# EAGLE board HDMI-LVDS (EAGLE 7.6.0)
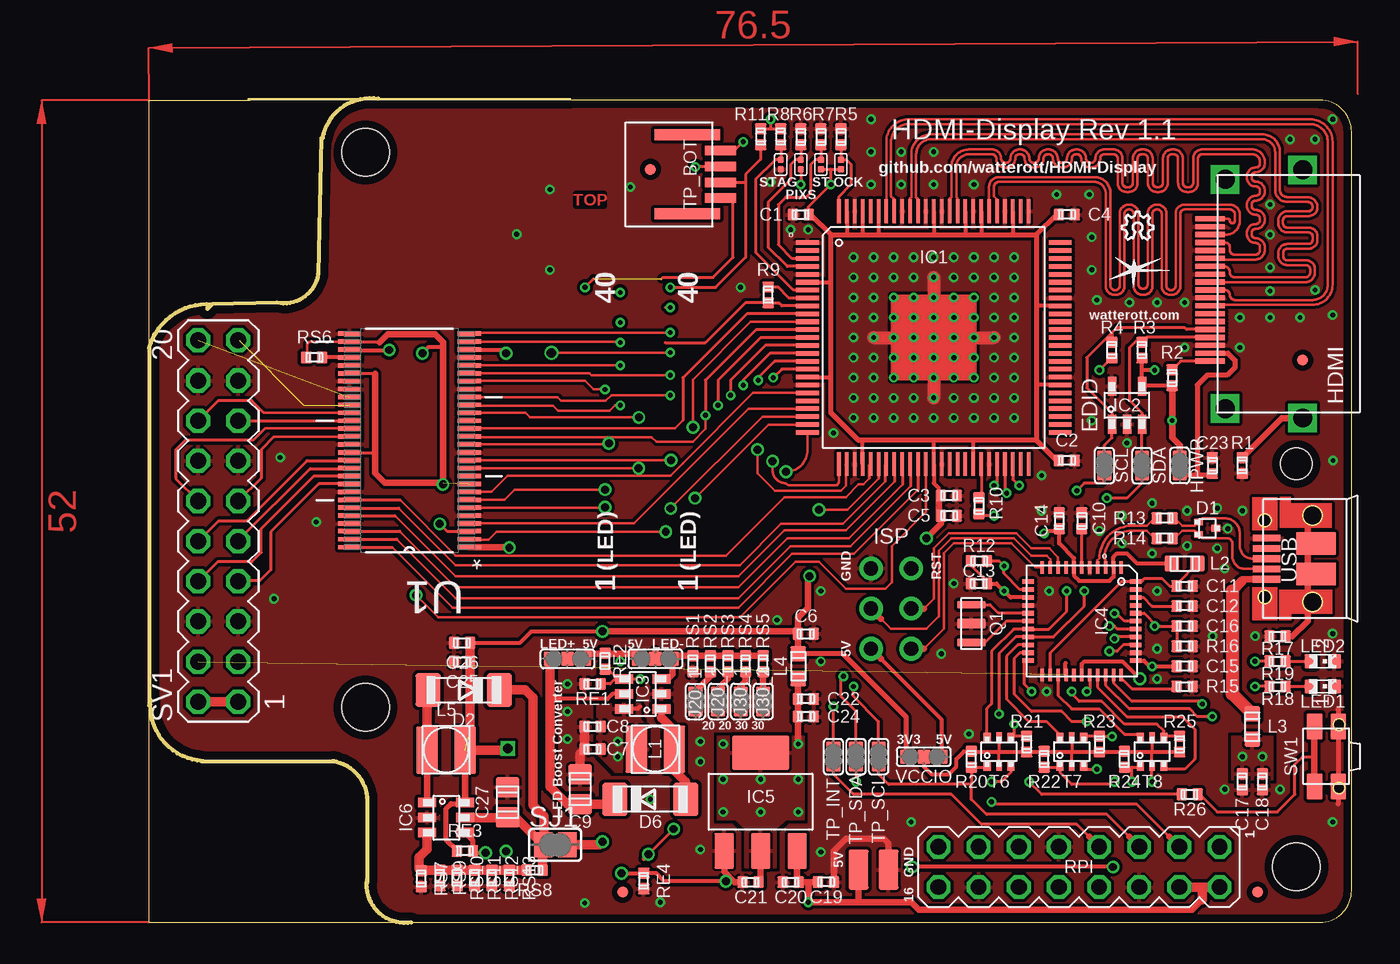
[diagram p2: board, top side]
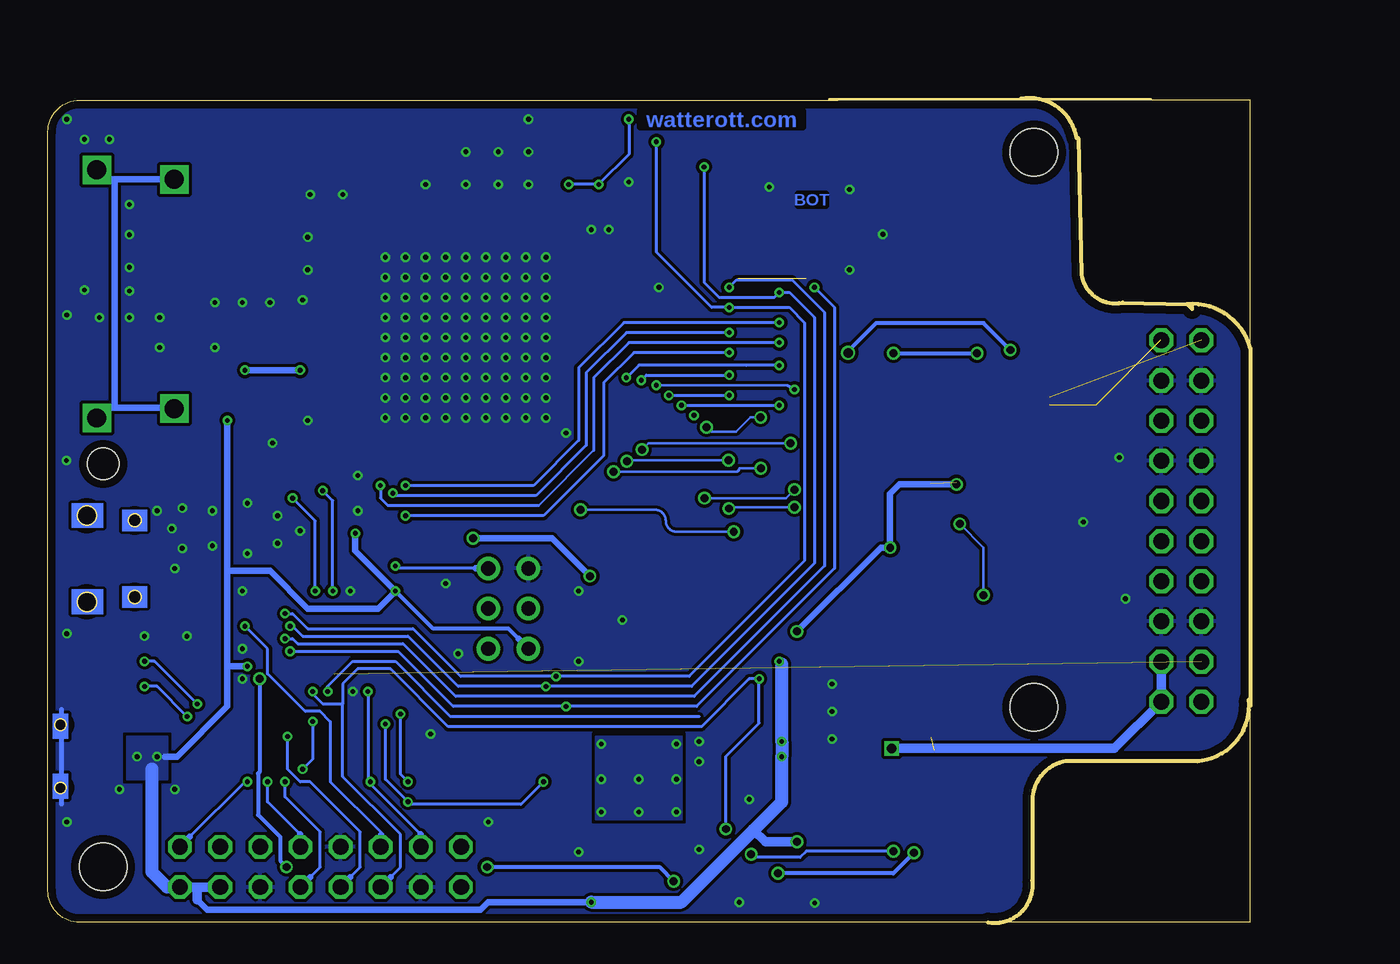
[diagram p3: board, bottom side, seen from below]

Size 76.1 x 52.18 mm. Coordinates in mm from the lower left corner, seen from the top.
Outline: 16.6,0.04 0,0.04 0,13.74 0,36.34
Outline: 16.6,0.04 74.1,0.04 arc90 76.1,2.04 76.1,50.04 arc90 74.1,52.04 26.1,52.04
Outline: 26.64,52.11 6.32,52.11
Outline: 0,36.34 0,52.04 6.4,52.04
Outline: 14.5,52.14 arc90 11,49.64 10.9,49.64 10.7,41.04 arc-94 8.1,39.24 4,39.14
Outline: 4,39.14 3.7,38.84 3.7,38.94
Outline: 0,36.34 arc-80 4,39.14
Outline: 3.4,10.24 arc-93 0.1,14.14
Outline: 3.3,10.24 11.6,10.24
Outline: 11.6,10.24 11.7,10.24
Outline: 11.6,10.24 arc-78 13.8,7.94 13.8,2.74
Outline: 13.8,2.74 13.8,2.54
Outline: 16.6,0.04 arc-108 13.8,2.74
Copper layers (1*16): Top 0.035mm / dielectric 1.5mm / Bottom 0.035mm
Design rules "default *": minimum track width 6mil, minimum drill 0.3mm, track to track 6mil, track to pad 6mil, pad to pad 6mil, via to via 6mil, smd to smd 6mil, copper to edge 20mil, drill to drill 6mil, minimum pad ring 8mil, minimum via ring 6mil, stop-mask expansion 4mil, vias tented up to drill 0.5mm, thermal gap 6mil
Net classes: 0 default: clearance 0.2 mm
Holes 3 mm at 72.6,3.54 13.7,13.64 13.7,48.74
Holes 2 mm at 72.6,29.04

## Footprints (pad centres in the part's own frame; a part is rotated, then mirrored left to right if it is on the bottom)
PAD-1.27X2.54_NC = smd 1.27 x 2.54: 1 0,0
C0402 = smd 0.75 x 0.7: 1 0,0.5; 2 0,-0.5
C0805 = smd 1.5 x 1.25: 1 0,0.95; 2 0,-0.95
SOT723 = smd 0.6 x 0.4: 1 -0.55,0.4; 2 -0.55,-0.4; 3 0.55,0
SOD106 = smd 2.1 x 1.6: A 0,-2.25; C 0,2.25
HDMI_10029449 = smd 1.9 x 0.3: 1 -0.95,4.75; 2 -0.95,4.25; 3 -0.95,3.75; 4 -0.95,3.25; 5 -0.95,2.75; 6 -0.95,2.25; 7 -0.95,1.75; 8 -0.95,1.25; 9 -0.95,0.75; 10 -0.95,0.25; 11 -0.95,-0.25; 12 -0.95,-0.75; 13 -0.95,-1.25; 14 -0.95,-1.75; 15 -0.95,-2.25; 16 -0.95,-2.75; 17 -0.95,-3.25; 18 -0.95,-3.75; 19 -0.95,-4.25 | drill 1.2 pad 1.8 square: SHLD1 0,-7.25; SHLD2 4.9,-7.85; SHLD3 4.9,7.85; SHLD4 0,7.25
JUMPER2-0402 = smd 0.9 x 0.8: 1 0,0.55; 2 0,-0.55
TQFP100-PAD = smd 1.5 x 0.28: 1 -8,6; 2 -8,5.5; 3 -8,5; 4 -8,4.5; 5 -8,4; 6 -8,3.5; 7 -8,3; 8 -8,2.5; 9 -8,2; 10 -8,1.5; 11 -8,1; 12 -8,0.5; 13 -8,0; 14 -8,-0.5; 15 -8,-1; 16 -8,-1.5; 17 -8,-2; 18 -8,-2.5; 19 -8,-3; 20 -8,-3.5; 21 -8,-4; 22 -8,-4.5; 23 -8,-5; 24 -8,-5.5; 25 -8,-6; 51 8,-6; 52 8,-5.5; 53 8,-5; 54 8,-4.5; 55 8,-4; 56 8,-3.5; 57 8,-3; 58 8,-2.5; 59 8,-2; 60 8,-1.5; 61 8,-1; 62 8,-0.5; 63 8,0; 64 8,0.5; 65 8,1; 66 8,1.5; 67 8,2; 68 8,2.5; 69 8,3; 70 8,3.5; 71 8,4; 72 8,4.5; 73 8,5; 74 8,5.5; 75 8,6 | smd 0.28 x 1.5: 26 -6,-8; 27 -5.5,-8; 28 -5,-8; 29 -4.5,-8; 30 -4,-8; 31 -3.5,-8; 32 -3,-8; 33 -2.5,-8; 34 -2,-8; 35 -1.5,-8; 36 -1,-8; 37 -0.5,-8; 38 0,-8; 39 0.5,-8; 40 1,-8; 41 1.5,-8; 42 2,-8; 43 2.5,-8; 44 3,-8; 45 3.5,-8; 46 4,-8; 47 4.5,-8; 48 5,-8; 49 5.5,-8; 50 6,-8; 76 6,8; 77 5.5,8; 78 5,8; 79 4.5,8; 80 4,8; 81 3.5,8; 82 3,8; 83 2.5,8; 84 2,8; 85 1.5,8; 86 1,8; 87 0.5,8; 88 0,8; 89 -0.5,8; 90 -1,8; 91 -1.5,8; 92 -2,8; 93 -2.5,8; 94 -3,8; 95 -3.5,8; 96 -4,8; 97 -4.5,8; 98 -5,8; 99 -5.5,8; 100 -6,8
SOT23-5 = smd 1.2 x 0.6: 1 -1.2,0.95; 2 -1.2,0; 3 -1.2,-0.95; 4 1.2,-0.95; 5 1.2,0.95
SOT23-6 = smd 1.2 x 0.6: 1 -1.2,0.95; 2 -1.2,0; 3 -1.2,-0.95; 4 1.2,-0.95; 5 1.2,0; 6 1.2,0.95
QFN44 = smd 0.8 x 0.28: 1 -3.4,2.5; 2 -3.4,2; 3 -3.4,1.5; 4 -3.4,1; 5 -3.4,0.5; 6 -3.4,0; 7 -3.4,-0.5; 8 -3.4,-1; 9 -3.4,-1.5; 10 -3.4,-2; 11 -3.4,-2.5; 23 3.4,-2.5; 24 3.4,-2; 25 3.4,-1.5; 26 3.4,-1; 27 3.4,-0.5; 28 3.4,0; 29 3.4,0.5; 30 3.4,1; 31 3.4,1.5; 32 3.4,2; 33 3.4,2.5 | smd 0.28 x 0.8: 12 -2.5,-3.4; 13 -2,-3.4; 14 -1.5,-3.4; 15 -1,-3.4; 16 -0.5,-3.4; 17 0,-3.4; 18 0.5,-3.4; 19 1,-3.4; 20 1.5,-3.4; 21 2,-3.4; 22 2.5,-3.4; 34 2.5,3.4; 35 2,3.4; 36 1.5,3.4; 37 1,3.4; 38 0.5,3.4; 39 0,3.4; 40 -0.5,3.4; 41 -1,3.4; 42 -1.5,3.4; 43 -2,3.4; 44 -2.5,3.4
SOT223 = smd 2.235 x 1.219: 1 -3.099,2.311; 2 -3.099,0; 3 -3.099,-2.311 | smd 2.2 x 3.6: 4 3.099,0
ISP-2X3 = drill 0.9 pad 1.5: GND 1.27,-2.54; MISO -1.27,2.54; MOSI 1.27,0; RST -1.27,-2.54; SCK -1.27,0; VCC 1.27,2.54
L_1212 = smd 3 x 1.4: 1 0,1.2; 2 0,-1.2
C0603 = smd 1 x 0.95: 1 0,0.8; 2 0,-0.8
C0603' = smd 0.9 x 0.8: A 0,-0.75; C 0,0.75
JUMPER3-0402 = smd 0.9 x 0.8: 1 0,1.1; 2 0,0; 3 0,-1.1
JUMPER2-0201_NC = smd 0.4 x 0.4: 1 0,0.3; 2 0,-0.3
CRYSTAL_32X13 = smd 1.8 x 0.5: 1 0,1.2; 2 0,-1.2 | smd 1.8 x 0.6: GND 0,0
MA08-2 = drill 1 octagon: 1 -1.27,8.89; 2 1.27,8.89; 3 -1.27,6.35; 4 1.27,6.35; 5 -1.27,3.81; 6 1.27,3.81; 7 -1.27,1.27; 8 1.27,1.27; 9 -1.27,-1.27; 10 1.27,-1.27; 11 -1.27,-3.81; 12 1.27,-3.81; 13 -1.27,-6.35; 14 1.27,-6.35; 15 -1.27,-8.89; 16 1.27,-8.89
SJ = smd 1.168 x 1.6: 1 -0.762,0; 2 0.762,0
MA10-2 = drill 1.016 octagon: 1 -11.43,-1.27; 2 -11.43,1.27; 3 -8.89,-1.27; 4 -8.89,1.27; 5 -6.35,-1.27; 6 -6.35,1.27; 7 -3.81,-1.27; 8 -3.81,1.27; 9 -1.27,-1.27; 10 -1.27,1.27; 11 1.27,-1.27; 12 1.27,1.27; 13 3.81,-1.27; 14 3.81,1.27; 15 6.35,-1.27; 16 6.35,1.27; 17 8.89,-1.27; 18 8.89,1.27; 19 11.43,-1.27; 20 11.43,1.27
PTS840P = smd 1.65 x 1: 1 -1.9,0.75; 2 1.9,0.75; 3 -1.9,-0.75; 4 1.9,-0.75 | hole 0.7: -2,-0.8; 2,-0.8
SOT363 = smd 0.6 x 0.5: 1 -0.9,0.75; 3 -0.9,-0.75; 4 0.9,-0.75; 6 0.9,0.75 | smd 0.6 x 0.4: 2 -0.9,0; 5 0.9,0
FPC04 = smd 2 x 0.6: 1 0,1.5; 2 0,0.5; 3 0,-0.5; 4 0,-1.5 | smd 4.2 x 0.7: SHLD1 2.1,2.5; SHLD2 2.1,-2.5
SOP50P810X120-56N = smd 1.473 x 0.279: 1 -3.785,6.756; 2 -3.785,6.248; 3 -3.785,5.74; 4 -3.785,5.258; 5 -3.785,4.75; 6 -3.785,4.242; 7 -3.785,3.759; 8 -3.785,3.251; 9 -3.785,2.743; 10 -3.785,2.261; 11 -3.785,1.753; 12 -3.785,1.245; 13 -3.785,0.762; 14 -3.785,0.254; 15 -3.785,-0.254; 16 -3.785,-0.762; 17 -3.785,-1.245; 18 -3.785,-1.753; 19 -3.785,-2.261; 20 -3.785,-2.743; 21 -3.785,-3.251; 22 -3.785,-3.759; 23 -3.785,-4.242; 24 -3.785,-4.75; 25 -3.785,-5.258; 26 -3.785,-5.74; 27 -3.785,-6.248; 28 -3.785,-6.756; 29 3.785,-6.756; 30 3.785,-6.248; 31 3.785,-5.74; 32 3.785,-5.258; 33 3.785,-4.75; 34 3.785,-4.242; 35 3.785,-3.759; 36 3.785,-3.251; 37 3.785,-2.743; 38 3.785,-2.261; 39 3.785,-1.753; 40 3.785,-1.245; 41 3.785,-0.762; 42 3.785,-0.254; 43 3.785,0.254; 44 3.785,0.762; 45 3.785,1.245; 46 3.785,1.753; 47 3.785,2.261; 48 3.785,2.743; 49 3.785,3.251; 50 3.785,3.759; 51 3.785,4.242; 52 3.785,4.75; 53 3.785,5.258; 54 3.785,5.74; 55 3.785,6.248; 56 3.785,6.756
USB-MICROB-10103594 = smd 1.8 x 0.4: D+ -2.885,0; D- -2.885,-0.65; GND -2.885,1.3; ID -2.885,0.65; VBUS -2.885,-1.3 | smd 2.5 x 1.425: SHLD1 0.25,-0.963; SHLD2 0.25,0.963 | hole 0.8: -3,2.425; -3,-2.425 | hole 1.2: 0.03,2.725; 0.03,-2.725
PASSER_07MM = smd 0.7 x 0.7: X 0,0

## Placement (x,y rotation side)
5V  PAD-1.27X2.54_NC  [PAD-1.27X2.54_NC]  44.9,3.37 0 top
C1  100n  [C0402]  41.25,44.8 90 top
C2  100n  [C0402]  58.07,29.25 270 top
C3  100n  [C0402]  50.61,27.02 270 top
C4  100n  [C0402]  58.07,44.8 270 top
C5  4u7  [C0402]  50.61,25.75 270 top
C6  4u7  [C0402]  41.56,18.29 90 top
C7  2u  [C0402]  28.07,10.99 90 top
C8  100n  [C0402]  28.07,12.42 90 top
C9  1u @ 40V  [C0805]  27.28,8.45 0 top
C10  1u  [C0402]  59.02,25.44 0 top
C11  100n  [C0402]  65.53,21.31 90 top
C12  100n  [C0402]  65.53,20.04 270 top
C13  100n  [C0402]  52.52,21.47 90 top
C14  100n  [C0402]  57.6,25.44 0 top
C15  100n  [C0402]  65.53,16.23 270 top
C16  tbd  [C0402]  65.53,18.77 270 top
C17  100n  [C0402]  69.19,8.93 180 top
C18  4u7  [C0402]  70.45,8.93 180 top
C19  4u7  [C0402]  42.83,2.58 270 top
C20  100n  [C0402]  40.61,2.58 90 top
C21  100n  [C0402]  38.07,2.58 90 top
C22  4u7  [C0402]  41.56,14.16 270 top
C23  100n  [C0402]  67.28,28.93 0 top
C24  4u7  [C0402]  41.56,13.05 270 top
C25  2u  [C0402]  19.81,16.51 90 top
C26  100n  [C0402]  19.81,17.72 90 top
C27  1u @ 40V  [C0805]  22.68,7.62 0 top
D1  D_ESD5V3U2U-03F  [SOT723]  66.96,24.96 0 top
D2  DIODE-SOD106  [SOD106]  19.91,14.73 270 top
D6  DIODE-SOD106  [SOD106]  31.72,7.81 90 top
GND  PAD-1.27X2.54_NC  [PAD-1.27X2.54_NC]  46.8,3.37 0 top
HDMI  HDMI-A  [HDMI_10029449]  68.1,39.79 0 top
HPWR  JUMPER2-0402  [JUMPER2-0402]  65.22,28.93 180 top
IC1  TFP401A-PAD  [TQFP100-PAD]  49.66,37.02 0 top
IC2  24LC02B  [SOT23-5]  61.88,32.74 90 top
IC3  IS31BL3506A-TTLS2  [SOT23-6]  31.24,14.48 180 top
IC4  ATMEGA32U4-MU  [QFN44]  59.02,19.09 270 top
IC5  LDO-TS1117CW-3V3  [SOT223]  38.7,7.66 90 top
IC6  IS31BL3506A-TTLS2  [SOT23-6]  18.81,6.66 0 top
ISP  ISP  [ISP-2X3]  46.96,19.88 180 top
J20_1  JUMPER2-0402  [JUMPER2-0402]  34.58,14.01 0 top
J20_2  JUMPER2-0402  [JUMPER2-0402]  36.01,14.01 0 top
J30_1  JUMPER2-0402  [JUMPER2-0402]  37.44,14.01 0 top
J30_2  JUMPER2-0402  [JUMPER2-0402]  38.86,14.01 0 top
L1  10u@500mA  [L_1212]  32.04,10.99 90 top
L2  [C0603]  65.53,22.74 90 top
L3  BLM18PG221SH1D  [C0603]  69.82,12.42 180 top
L4  BLM18PG221SH1D  [C0603]  41.09,16.23 0 top
L5  10u@500mA  [L_1212]  18.8,10.93 270 top
LED1  green  [C0603']  74.27,14.96 270 top
LED2  red  [C0603']  74.27,16.55 270 top
LED+  JUMPER3-0402  [JUMPER3-0402]  26.48,16.7 90 top
LED-  JUMPER3-0402  [JUMPER3-0402]  32.04,16.7 270 top
LOGO1  OSHW_LOGOX0070  [OSHW_6X70]  61.57,43.22 0 top
LOGO3  LOGO-S_PLACE_S  [SPARK_TPLACE_S]  62.36,41.31 0 top
OCK  JUMPER2-0201-NC  [JUMPER2-0201_NC]  43.78,47.98 0 top
PIXS  JUMPER2-0201-NC  [JUMPER2-0201_NC]  41.25,47.98 0 top
Q1  16MHz  [CRYSTAL_32X13]  52.04,18.93 0 top
R1  0  [C0402]  69.19,28.93 180 top
R2  1k  [C0402]  64.74,34.48 0 top
R3  10k  [C0402]  62.84,36.23 180 top
R4  10k  [C0402]  60.93,36.23 180 top
R5  10k  [C0402]  43.78,49.72 0 top
R6  10k  [C0402]  41.25,49.72 0 top
R7  10k  [C0402]  42.52,49.72 0 top
R8  10k  [C0402]  39.98,49.72 180 top
R9  1k  [C0402]  39.18,39.72 180 top
R10  22  [C0402]  52.52,26.39 0 top
R11  nc  [C0402]  38.7,49.72 180 top
R12  10k  [C0402]  52.52,22.9 270 top
R13  22  [C0402]  64.26,25.59 270 top
R14  22  [C0402]  64.26,24.32 270 top
R15  10k  [C0402]  65.53,14.96 90 top
R16  tbd  [C0402]  65.53,17.5 270 top
R17  0  [C0402]  71.41,18.13 90 top
R18  4k7  [C0402]  71.41,14.96 90 top
R19  4k7  [C0402]  71.41,16.55 90 top
R20  4k7  [C0402]  52.04,10.35 180 top
R21  4k7  [C0402]  55.53,11.31 0 top
R22  4k7  [C0402]  56.64,10.35 180 top
R23  4k7  [C0402]  60.14,11.31 0 top
R24  4k7  [C0402]  61.72,10.35 180 top
R25  4k7  [C0402]  65.22,11.31 0 top
R26  1k  [C0402]  65.85,8.13 90 top
RE1  100k  [C0402]  28.07,15.12 90 top
RE2  NM  [C0402]  28.86,16.55 180 top
RE3  NM  [C0402]  19.99,4.55 270 top
RE4  100k  [C0402]  31.31,2.65 180 top
RPI  MA08-2  [MA08-2]  58.85,3.54 270 top
RS1  15  [C0402]  34.42,16.39 180 top
RS2  15  [C0402]  35.53,16.39 180 top
RS3  15  [C0402]  36.64,16.39 180 top
RS4  10  [C0402]  37.75,16.39 180 top
RS5  10  [C0402]  38.86,16.39 180 top
RS6  10  [C0402]  10.45,35.77 270 top
RS7  1  [C0402]  17.23,2.8 180 top
RS8  16.5  [C0402]  24.4,3.34 90 top
RS9  1  [C0402]  18.4,2.84 180 top
RS10  1  [C0402]  19.5,2.84 180 top
RS11  1  [C0402]  20.6,2.84 180 top
RS12  1  [C0402]  21.7,2.84 180 top
RS13  1  [C0402]  22.8,2.84 180 top
SCL  JUMPER2-0402  [JUMPER2-0402]  60.45,28.93 0 top
SDA  JUMPER2-0402  [JUMPER2-0402]  62.84,28.93 0 top
SJ1  [SJ]  25.7,4.94 0 top
ST  JUMPER2-0201-NC  [JUMPER2-0201_NC]  42.52,47.98 0 top
STAG  JUMPER2-0201-NC  [JUMPER2-0201_NC]  39.98,47.98 180 top
SV1  [MA10-2]  4.38,25.42 90 top
SW1  SW-TACTILE-PTS840P  [PTS840P]  74.5,10.54 90 top
T6  BSS138PS  [SOT363]  53.79,10.83 90 top
T7  BSS138PS  [SOT363]  58.39,10.83 90 top
T8  BSS138PS  [SOT363]  63.47,10.83 90 top
TP_BOT  FPC04  [FPC04]  36.16,47.34 180 top
TP_INT  JUMPER2-0402  [JUMPER2-0402]  43.31,10.51 0 top
TP_SCL  JUMPER2-0402  [JUMPER2-0402]  46.17,10.51 0 top
TP_SDA  JUMPER2-0402  [JUMPER2-0402]  44.74,10.51 0 top
U1  SN75LVDS83BDGG  [SOP50P810X120-56N]  16.48,30.52 180 top
USB  USB-MICROB  [USB-MICROB-10103594]  73.6,23.04 0 top
VCCIO  JUMPER3-0402  [JUMPER3-0402]  49.02,10.51 270 top
X1  PASSER-07  [PASSER_07MM]  29.97,1.94 90 top
X2  PASSER-07  [PASSER_07MM]  31.72,47.66 90 top
X3  PASSER-07  [PASSER_07MM]  73,35.6 90 top
X4  PASSER-07  [PASSER_07MM]  70.14,1.94 90 top

## Tracks (layer width: path | path; a pad name or v marks a point on that pad's centre or on a via)
3VOUT  (via drill 0.3)
  Top 0.406: IC5.2 38.7,2.71 C21.2 | L4.2 41.06,15.41 C22.2 C24.2 41.06,11.6
  other vias: 36.32,11.31 36.32,7.02 41.09,7.02 41.09,11.31 41.09,9.08 36.32,9.08 38.7,7.02 38.7,9.08
  pour Bottom: 36.01,11.78 41.4,11.78 41.4,6.54 36.01,6.54
  pour Top: 36.01,11.78 41.4,11.78 41.4,6.54 40.29,6.54 39.66,5.91 39.66,3.53 37.75,3.53 37.75,5.91 37.12,6.54 36.01,6.54
+3V3  (via drill 0.3, 0.5 pad 0.25, 0.5 pad 0.61, 0.6)  (2 unrouted)
  Top 0.15: RS6.2 arc90 10,35.82 10,36.54 arc-90 10.23,36.76 U1.30
  Top 0.2: U1.1 20.29,23.74 v22.8,23.74 | 14.6,36.74 12.72,36.74 U1.30 | U1.34 14.28,34.76 14.3,34.74 | U1.44 14.28,29.75 14.3,29.74
  Top 0.203: 44.16,43.59 44.1,43.53 | 46.16,43.54 46.17,43.53 | 54.66,43.61 54.58,43.53 | 52.66,43.55 52.67,43.53 | 51.66,43.6 51.72,43.53 | 56.23,39.03 56.17,39.09 | 56.18,34.03 56.17,34.01 | 52.16,30.48 52.2,30.52 | 45.16,30.46 45.21,30.52 | 43.14,40.53 43.15,40.52 | 43.13,40.03 43.15,40.04 | 43.11,34.53 43.15,34.49 | 45.16,43.59 45.21,43.53 | 49.98,27.5 49.98,27.02 C3.2 | ST.2 43.15,47.68 | 43.15,47.68 OCK.2 | R11.2 39.34,50.23 | 39.34,50.23 R8.2 | PIXS.2 v41.25,46.71 | 43.15,47.68 v43.15,46.71 41.75,45.3 C1.2 | v39.34,50.84 39.34,50.23 | C5.2 49.99,25.75 49.98,25.77
  Top 0.254: IC1.99 44.16,43.59 | IC1.95 46.16,43.54 | IC1.78 54.66,43.61 | IC1.82 52.66,43.55 | IC1.84 51.66,43.6 | IC1.88 49.66,43.53 | IC1.67 56.23,39.03 | IC1.57 56.18,34.03 | IC1.43 52.16,30.48 | 49.66,30.52 IC1.38 49.66,27.82 49.98,27.5 | IC1.29 45.16,30.46 | IC1.6 43.14,40.53 | IC1.18 43.11,34.53 | IC1.97 45.16,43.59 | 56.17,43.53 56.17,43.55 | 43.15,43.53 43.15,43.55 | 56.17,30.52 56.17,30.5 | U1.26 22.38,36.26 v22.6,36.04 | C26.2 23.48,17.72 24.2,18.44 v28.7,18.44 | v17.3,36.04 17.7,36.44 18.6,36.44
  Top 0.305: 56.17,43.53 54.58,43.53 52.67,43.53 51.72,43.53 49.66,43.53 46.17,43.53 45.21,43.53 44.1,43.53 43.15,43.53 43.15,40.52 43.15,40.04 43.15,34.49 43.15,32.26 44.9,30.52 45.21,30.52 49.66,30.52 52.2,30.52 56.17,30.52 | 56.17,43.53 56.17,39.09 56.17,34.01 56.17,30.52 | C2.2 57.44,29.25 56.17,30.52 | C4.2 57.44,44.8 56.17,43.53 | C1.2 41.9,44.8 43.15,43.55 | VCCIO.3 47.92,13.01 43.9,17.04 L4.1 | RE3.2 | RE3.2 18.8,5.24 18.8,7.24 19.1,7.54 19.94,7.54 IC6.6
  Top 0.406: 49.98,27.02 49.98,25.77 | C6.1 41.06,17.05 L4.1 | C6.1 41.06,19.3 41.7,19.94 41.7,21.84 v41.8,21.94 | v49.2,24.34 50.11,25.25 C5.2 | v28.7,18.44 40.92,18.44 C6.1 | U1.1 22.78,23.76 v22.8,23.74 | v18.6,27.74 18.6,27.84 | 18.6,27.84 18.6,36.44 18.6,36.74 18.1,37.24 15.1,37.24 14.6,36.74 | 18.6,27.84 14.9,27.84 14.3,28.44 14.3,29.74 14.3,34.74 | IC6.6 L5.1
  Top 0.61: C26.2 C25.2 20.31,11.85 20.2,11.74 | L5.1 22.7,10.93 v22.7,11.04 | SV1.1 SV1.2
  Bottom 0.203: v43.15,46.71 v41.25,46.71 39.34,48.61 v39.34,50.84
  Bottom 0.254: v22.6,36.04 v17.3,36.04
  Bottom 0.406: v41.8,21.94 44.2,24.34 v49.2,24.34 | v28.7,18.44 23.4,23.74 v22.8,23.74 22.8,27.14 22.2,27.74 v18.6,27.74
  Bottom 0.61: v22.7,11.04 8.6,11.04 SV1.1 SV1.3
+5V  (via drill 0.3, 0.5 pad 0.25)
  Top 0.203: LED-.3 30.94,16.85 30.93,16.86 | 50.14,10.53 VCCIO.1 | R4.1 60.91,35.73 v60.14,34.96 | 62.83,35.58 R3.1 | C13.2 53.02,21.6 52.04,22.58 52.04,22.87 R12.2
  Top 0.254: 31.09,13.69 30.93,13.53 IC3.6 | IC4.34 62.95,16.59 63.31,16.23 v63.47,16.23 C15.2 | L2.1 62.52,22.74 61.88,23.37 61.25,23.37 61.02,23.15 IC4.2 61.02,21.88 60.77,21.63 58.87,21.63 58.52,21.97 IC4.7 58.52,23.08 57.6,24.01 C14.2 | 57.6,24.64 C14.2 | IC4.14 54.51,20.59 v54.1,20.99 53.63,21.47 C13.2 | v56.64,24.64 56.8,24.8 57.6,24.8 C14.2 | 62.83,34.96 IC2.4 62.88,33.99 R2.2 | 62.83,34.96 62.83,35.58 | v63.63,34.96 62.83,34.96 | 46.33,16.71 50.14,12.9 50.14,10.53
  Top 0.406: 44.9,1.31 v41.72,1.31 41.72,2.58 | 44.9,1.31 48.23,1.31 48.71,0.83 66.01,0.83 66.64,1.46 | HPWR.2 65.22,30.2 64.74,30.68 v64.74,31.79 R2.2 | LED+.3 27.59,16.71 27.59,17.02 28.86,17.02 RE2.2 28.89,17.02 29.82,17.02 | 30.93,16.86 30.93,17.02 29.82,17.02 | 29.82,17.02 v29.82,16.55 | ISP.VCC 46.33,16.71 | IC5.3 41.02,2.67 C20.2 41.72,2.58 | 41.72,2.58 C19.2 | 5V.1 44.9,1.31
  Top 0.61: RPI.2 66.65,2.27 | 66.65,2.27 RPI.4 | 66.65,2.27 66.64,2.26 66.64,1.46 | 28.66,5.17 v28.7,5.14 28.5,4.94 SJ1.2
  Bottom 0.254: 46.33,17.98 46.96,18.61 51.72,18.61 v54.1,20.99
  Bottom 0.406: 64.74,22.26 62.04,22.26 59.66,19.88 55.22,19.88 v54.1,20.99 56.64,23.53 v56.64,24.64 | 64.74,22.26 64.74,16.23 | v63.47,16.23 64.74,16.23 | 68.71,10.51 67.91,10.51 64.74,13.69 64.74,16.23 | v60.14,34.96 v63.63,34.96 | v41.72,1.31 48.23,1.31 48.71,0.83 66.01,0.83 66.65,1.47 | RPI.4 65.22,2.26 | 64.74,22.26 v64.74,31.79 | ISP.VCC 46.33,17.98
  Bottom 0.61: 65.22,2.26 66.65,2.26 | 66.65,2.26 67.76,2.26 | 66.65,1.47 66.65,2.26 | 29.66,16.39 v29.82,16.55 | v28.7,5.14 30.7,5.14 31.44,5.87
  Bottom 0.813: 69.5,9.72 69.5,3.21 68.56,2.27 RPI.2 | 29.66,16.39 v29.66,11.47 v29.66,10.51 29.66,7.66 31.44,5.87 36.01,1.31 v41.72,1.31
  other vias: 70.45,10.51 69.19,10.51
  pour Top: 28.39,13.85 28.39,10.67 29.5,9.56 31.56,9.56 31.56,12.42 31.09,12.89 31.09,13.85
  pour Top: 68.55,11.78 68.55,9.08 71.09,9.08 71.09,11.78
  pour Bottom: 68.55,9.08 71.09,9.08 71.09,11.78 68.55,11.78
AREF
  Top 0.203: IC4.42 62.92,20.59 63.47,20.04 C12.2
AVCC
  Top 0.203: IC4.24 57.02,17.09 61.52,21.59 IC4.44 62.8,21.59 62.99,21.79 64.11,21.79 64.58,21.31 C11.1 65.06,21.33 65.06,21.47 L2.2
B0
  Top 0.152: 20.27,31.28 U1.16 33.28,31.28 33.78,31.79
  Top 0.203: IC1.10 37.82,38.53 33.78,34.49 33.78,31.79
B1  (via drill 0.5 pad 0.25)
  Top 0.152: IC1.11 41.65,38.01 38.06,38.01 34.42,34.37 34.42,31.81 v34.42,31.36 | v31,31.98 24.11,31.98 23.83,32.26 U1.18
  Bottom 0.152: v34.42,31.36 34.12,31.06 32.55,31.06 31.63,31.98 v31,31.98
B2  (via drill 0.3)
  Top 0.152: U1.15 20.3,30.73 31.81,30.73 32.11,30.44 34.42,30.44 35.22,31.24 35.22,32.09 v35.21,32.1
  Top 0.203: IC1.12 38.41,37.53 35.21,34.33 v35.21,32.1
  Bottom 0.203: 35.05,32.26 v35.21,32.1
B3  (via drill 0.3)
  Top 0.152: 29.78,32.78 v29.82,32.74 29.49,32.74 29.15,32.4 25.9,32.4 25.57,32.72 20.32,32.72 U1.19
  Top 0.203: IC1.13 38.7,37.03 36.01,34.33 v36.01,32.74 | v29.82,32.74
  Bottom 0.203: v36.01,32.74 v29.82,32.74
B4  (via drill 0.3)
  Top 0.152: U1.20 20.33,33.19 20.4,33.26 25.85,33.26 26.09,33.02 28.9,33.02 29.25,33.37 v32.99,33.37
  Top 0.203: IC1.14 39,36.53 36.8,34.33 v36.8,33.37
  Bottom 0.203: v36.8,33.37 v32.99,33.37
B5  (via drill 0.3)
  Top 0.152: 28.84,33.76 v28.86,33.75 28.13,33.75 27.6,34.28 U1.22
  Top 0.203: IC1.15 39.29,36.03 37.59,34.33 v37.59,34.01
  Bottom 0.203: v28.86,33.75 29.3,33.99 v37.59,34.01
B6  (via drill 0.3)
  Top 0.152: U1.23 | v32.99,34.64 v32.98,34.65 27.99,34.65 27.89,34.76 U1.23
  Top 0.203: IC1.16 39.59,35.53 38.55,34.49 v38.55,34.33
  Top 0.254: U1.23
  Bottom 0.203: v38.55,34.33 38.23,34.64 v32.99,34.64
B7  (via drill 0.3)
  Top 0.152: v29.82,35.27 U1.24
  Top 0.203: IC1.17 40.04,35.03 v39.5,34.49
  Bottom 0.203: v29.82,35.27 31.92,35.27 32.51,35.28 38.7,35.28 v39.5,34.49
CLK  (via drill 0.3, 0.5 pad 0.25, 0.6 pad 0.25)
  Top 0.152: U1.31 12.71,36.27 | v25.47,36.06 32.98,36.06 v32.99,36.07
  Top 0.203: v53.47,25.75 52.52,25.75 R10.2
  Top 0.254: 12.71,36.27 12.74,36.24 v15.2,36.24
  Bottom 0.152: 25.26,36.27 v25.47,36.06
  Bottom 0.203: v32.99,36.07 39.02,36.07 40.93,34.17 40.93,29.56 44.74,25.75 v53.47,25.75
  Bottom 0.254: v15.2,36.24 16.9,37.94 23.7,37.94 25.47,36.17 v25.47,36.06
CLK+
  Top 0.15: U1.39 7.27,32.27
  Top 0.2: 7.27,32.27 6.5,33.04 4.38,33.04 SV1.16
CLK-
  Top 0.2: U1.40 12.67,31.74 5.68,31.74 SV1.15
CLK_N
  Top 0.152: IC1.94 46.66,45.75 46.65,45.76 46.65,49.41 arc-90 48.07,50.83 73.47,50.83 arc-90 74.89,49.41 74.89,40.36 arc-90 73.63,39.1 67.21,39.1 HDMI.12
CLK_P
  Top 0.152: IC1.93 47.16,45.77 46.95,45.98 46.95,49.41 arc-90 48.07,50.53 73.47,50.53 arc-90 74.59,49.41 74.59,40.36 arc-90 73.63,39.4 68.72,39.4 arc-90 68.39,39.72 arc90 68.08,40.04 HDMI.10
D0_N
  Top 0.152: IC1.91 48.16,45.84 48.24,45.92 48.24,48.61 arc-90 49.5,49.88 70.45,49.88 arc-90 71.56,48.77 71.56,46.39 arc90 72.04,45.91 73.31,45.91 arc-90 73.94,45.28 arc-90 73.37,44.71 72.02,44.71 arc90 71.76,44.44 71.76,44.25 arc90 72.02,43.98 73.37,43.98 arc-90 73.94,43.41 73.94,43.21 arc-90 73.37,42.64 72.03,42.64 arc90 71.77,42.37 71.77,42.18 arc90 72.03,41.91 73.21,41.91 arc-90 73.78,41.34 73.78,41.15 arc-90 73.15,40.52 67.91,40.52 67.9,40.54 HDMI.9
D0_P
  Top 0.152: IC1.90 48.66,45.8 48.54,45.92 48.54,48.61 arc-90 49.5,49.57 70.45,49.57 arc-90 71.25,48.77 71.25,46.39 arc90 72.04,45.6 73.31,45.6 arc-90 73.64,45.28 arc-90 73.37,45.01 72.03,45.01 arc90 71.46,44.44 71.46,44.25 arc90 72.03,43.67 73.37,43.67 arc-90 73.64,43.41 73.64,43.21 arc-90 73.37,42.95 72.03,42.95 arc90 71.46,42.37 71.46,42.18 arc90 72.03,41.61 73.21,41.61 arc-90 73.48,41.34 73.48,41.15 arc-90 73.15,40.83 68.72,40.83 arc-90 68.39,41.15 arc90 68.01,41.54 HDMI.7
D1_N
  Top 0.152: IC1.86 50.66,45.8 50.78,45.92 50.78,47.82 arc-90 51.88,48.93 53.35,48.93 arc-90 53.92,48.35 arc90 54.18,48.09 54.24,48.09 arc90 54.51,48.35 arc-90 55.08,48.93 55.14,48.93 arc-90 55.71,48.35 arc90 55.98,48.09 56.03,48.09 arc90 56.3,48.35 arc-90 56.87,48.93 56.93,48.93 arc-90 57.5,48.35 arc90 57.77,48.09 57.82,48.09 arc90 58.09,48.35 arc-90 58.66,48.93 58.72,48.93 arc-90 59.29,48.35 arc90 59.56,48.09 59.62,48.09 arc90 59.88,48.35 arc-90 60.45,48.93 61.03,48.93 arc-90 61.6,48.35 61.6,46.8 arc90 61.87,46.54 61.98,46.54 arc90 62.25,46.8 62.25,48.35 arc-90 62.82,48.93 62.94,48.93 arc-90 63.51,48.35 63.51,46.81 arc90 63.78,46.54 63.9,46.54 arc90 64.16,46.81 64.16,48.35 arc-90 64.73,48.93 64.85,48.93 arc-90 65.42,48.35 65.42,46.8 arc90 65.69,46.54 65.81,46.54 arc90 66.07,46.8 66.07,48.35 arc-90 66.65,48.93 69.82,48.93 arc-90 70.61,48.14 70.61,48.05 arc-90 70.04,47.48 arc90 69.77,47.21 69.77,47.16 arc90 70.04,46.89 arc-90 70.61,46.32 70.61,46.26 arc-90 70.04,45.69 arc90 69.77,45.42 69.77,45.37 arc90 70.04,45.1 arc-90 70.61,44.53 70.61,44.47 arc-90 70.04,43.9 arc90 69.77,43.63 69.77,43.58 arc90 70.04,43.31 arc-90 70.61,42.74 70.61,42.58 arc-90 69.98,41.95 67.23,41.95 HDMI.6
D1_P
  Top 0.152: IC1.85 51.16,45.84 51.08,45.92 51.08,47.82 arc-90 51.88,48.62 53.35,48.62 arc-90 53.61,48.35 arc90 54.18,47.78 54.24,47.78 arc90 54.81,48.35 arc-90 55.08,48.62 55.14,48.62 arc-90 55.4,48.35 arc90 55.98,47.78 56.03,47.78 arc90 56.6,48.35 arc-90 56.87,48.62 56.93,48.62 arc-90 57.2,48.35 arc90 57.77,47.78 57.82,47.78 arc90 58.4,48.35 arc-90 58.66,48.62 58.72,48.62 arc-90 58.99,48.35 arc90 59.56,47.78 59.62,47.78 arc90 60.19,48.35 arc-90 60.45,48.62 61.03,48.62 arc-90 61.3,48.35 61.3,46.8 arc90 61.87,46.23 61.98,46.23 arc90 62.56,46.8 62.56,48.35 arc-90 62.82,48.62 62.94,48.62 arc-90 63.21,48.35 63.21,46.8 arc90 63.78,46.23 63.9,46.23 arc90 64.47,46.8 64.47,48.35 arc-90 64.73,48.62 64.85,48.62 arc-90 65.12,48.35 65.12,46.8 arc90 65.69,46.23 65.81,46.23 arc90 66.38,46.8 66.38,48.35 arc-90 66.65,48.62 69.82,48.62 arc-90 70.3,48.14 70.3,48.05 arc-90 70.04,47.78 arc90 69.46,47.21 69.46,47.16 arc90 70.04,46.58 arc-90 70.3,46.32 70.3,46.26 arc-90 70.04,45.99 arc90 69.46,45.42 69.46,45.37 arc90 70.04,44.8 arc-90 70.3,44.53 70.3,44.47 arc-90 70.04,44.21 arc90 69.46,43.63 69.46,43.58 arc90 70.04,43.01 arc-90 70.3,42.74 70.3,42.58 arc-90 69.98,42.26 68.72,42.26 arc-90 68.39,42.58 68.39,42.74 arc90 68.09,43.04 HDMI.4
D2_N
  Top 0.152: 53.16,45.92 | 53.16,45.92 53.16,46.55 arc-90 53.79,47.18 59.82,47.18 arc-90 60.84,46.15 60.84,40.3 arc90 61.11,40.03 61.16,40.03 arc90 61.42,40.3 61.42,44.86 arc-90 62,45.43 62.04,45.43 arc-90 62.61,44.86 62.61,40.38 arc90 62.88,40.12 62.93,40.12 arc90 63.19,40.38 63.19,44.86 arc-90 63.76,45.43 63.81,45.43 arc-90 64.38,44.86 64.38,40.3 arc90 64.65,40.03 64.7,40.03 arc90 64.96,40.3 64.96,44.86 arc-90 65.53,45.43 68.39,45.43 arc-90 69.02,44.8 69.02,44.65 arc-90 69.03,44.64 69.03,44.42 arc-90 68.14,43.54 HDMI.3 | IC1.81 53.16,45.92
D2_P
  Top 0.152: IC1.80 53.66,45.78 53.46,45.98 53.46,46.55 arc-90 53.79,46.87 59.82,46.87 arc-90 60.54,46.15 60.54,40.3 arc90 61.11,39.72 61.16,39.72 arc90 61.73,40.3 61.73,44.86 arc-90 62,45.13 62.04,45.13 arc-90 62.31,44.86 62.31,40.3 arc90 62.88,39.72 62.93,39.72 arc90 63.5,40.3 63.5,44.86 arc-90 63.76,45.13 63.81,45.13 arc-90 64.08,44.86 64.08,40.3 arc90 64.65,39.72 64.7,39.72 arc90 65.27,40.3 65.27,44.86 arc-90 65.53,45.13 68.39,45.13 arc-90 68.72,44.8 68.72,44.43 arc-90 68.55,44.26 arc-90 68.39,44.42 arc90 68.27,44.54 HDMI.1
D_N
  Top 0.152: R14.2 63.63,24.33 63.15,24.8 62.19,24.8 arc90 60.45,23.06 60.52,22.98 IC4.3
D_P
  Top 0.152: R13.2 63.63,25.6 63.15,25.12 62.21,25.12 arc90 60.14,23.06 60.02,22.94 IC4.4
DDC_SCL
  Top 0.203: SCL.1 60.45,30.2 60.93,30.68 IC2.1 60.93,32.26 59.34,33.85 59.34,35.76 60.93,37.34 | 60.93,37.34 R4.2 | HDMI.15 65.66,37.54 65.53,37.66 61.25,37.66 60.93,37.34
DDC_SDA
  Top 0.152: IC2.3
  Top 0.203: IC2.3 62.84,32.26 62.04,33.06 62.04,36.39 62.44,36.79 62.84,36.79 R3.2 63.14,37.04 HDMI.16 | SDA.1 IC2.3
DE  (via drill 0.3)
  Top 0.203: IC1.46 53.66,27.85 v53.47,27.66
  Bottom 0.2: 42.52,30.52 45.37,27.66
  Bottom 0.203: v29.82,37.98 39.66,37.98 42.52,35.12 42.52,30.52 | 45.37,27.66 v53.47,27.66
G0
  Top 0.15: 33.78,29.09 38.23,33.53 IC1.20
  Top 0.152: 33.78,29.09 33.78,29.06 33,28.28 22.69,28.28 21.67,27.26 20.27,27.26 U1.8
  Top 0.203: IC1.20
G2
  Top 0.15: 30.69,25.28 20.28,25.28
  Top 0.152: IC1.22 37.94,32.53 30.69,25.28 | 20.28,25.28 U1.4
G3  (via drill 0.5 pad 0.25)
  Top 0.152: U1.6 28.85,26.27 v28.86,26.28 | IC1.23 38.82,32.03 v33.01,26.21
  Bottom 0.152: v33.01,26.21 32.94,26.28 v28.86,26.28
G4  (via drill 0.5 pad 0.25)
  Top 0.152: IC1.24 39.21,31.53 v34.55,26.87 | v28.86,27.41 23.13,27.41 22.49,26.76 20.27,26.76 U1.7
  Bottom 0.152: v34.55,26.87 29.4,26.87 v28.86,27.41
G5  (via drill 0.5 pad 0.25)
  Top 0.15: IC1.25 41.66,29.9 arc-90 v40.3,28.54
  Top 0.152: U1.11 v30.98,28.76 v30.99,28.76
  Bottom 0.15: v40.3,28.54 32.57,28.54 arc-90 32.34,28.76
  Bottom 0.152: v30.99,28.76 32.34,28.76
G6  (via drill 0.5 pad 0.25)
  Top 0.15: IC1.26 43.66,27.86 43.53,27.69 40.46,27.69 40.28,27.81 arc-90 39.46,28.63 v39.46,29.21
  Top 0.152: U1.12 33.02,29.27 v33.03,29.26
  Top 0.203: IC1.26 43.66,28.64 43.63,28.61
  Bottom 0.15: v33.03,29.26 39.42,29.26
  Bottom 0.152: 39.42,29.26 v39.46,29.21
G7  (via drill 0.5 pad 0.61)
  Top 0.15: 44.1,28.97 44.1,27.64 43.8,27.34 39.6,27.34 38.5,28.44 v38.5,29.94 | v29.1,30.34 29.03,30.26 U1.14
  Top 0.2: IC1.27 44.1,28.97
  Bottom 0.15: v38.5,29.94 38.1,30.34 v29.1,30.34
GND  (via drill 0.3)
  Top 0.254: SW1.4 75.25,12.58
  Top 0.305: 75.25,13.5 75.25,12.58 | SW1.4 SW1.3 75.25,7.53
  Top 0.406: C21.1 37.06,2.58 36.4,3.24 IC5.1 | C19.1 43.33,4.57 44.1,5.34 46.5,5.34 46.8,5.04 GND.1
  Top 0.61: C9.1 27.28,10.7 C7.1 C8.1
  Top 0.813: v45.85,37.03 v53.47,37.03 | v49.66,40.84 v49.66,33.22
  Bottom 0.305: 75.25,13.5 75.25,12.58 | SW1.4 75.25,7.53
  other vias: 49.66,37.02 48.39,37.02 50.93,37.02 52.2,37.02 53.47,38.29 52.2,38.29 50.93,38.29 49.66,38.29 48.39,38.29 47.12,38.29 45.85,38.29 47.12,37.02 45.85,39.56 45.85,40.83 47.12,40.83 48.39,40.83 44.58,40.83 44.58,39.56 44.58,38.29 44.58,37.02 54.74,37.02 54.74,38.29 53.47,39.56 54.74,39.56 50.93,39.56 52.2,39.56 49.66,39.56 48.39,39.56 47.12,39.56 45.85,42.1 47.12,42.1 48.39,42.1 49.66,42.1 44.58,42.1 50.93,40.83 52.2,40.83 53.47,40.83 54.74,40.83 50.93,42.1 52.2,42.1 53.47,42.1 54.74,42.1 50.93,33.21 52.2,33.21 53.47,33.21 54.74,33.21 45.85,34.48 45.85,35.75 47.12,35.75 48.39,35.75 49.66,35.75 44.58,35.75 44.58,34.48 53.47,34.48 54.74,34.48 50.93,34.48 52.2,34.48 49.66,34.48 48.39,34.48 47.12,34.48 50.93,35.75 52.2,35.75 53.47,35.75 54.74,35.75 45.85,31.94 45.85,33.21 47.12,33.21 48.39,33.21 44.58,33.21 44.58,31.94 53.47,31.94 54.74,31.94 50.93,31.94 52.2,31.94 49.66,31.94 48.39,31.94 47.12,31.94 43.31,30.99 26.48,11.62 10.58,25.35 69.03,36.39 52.2,46.71 49.66,46.71 47.59,46.71 59.5,46.07 57.44,46.07 69.03,38.29 65.53,39.25 45.69,48.77 45.69,50.84 70.93,38.29 72.84,38.29 74.9,38.45 63.79,39.25 62.04,39.25 59.98,39.41 59.66,41.31 59.66,43.37 74.9,50.84 68.26,24.94 69.19,26.07 56.96,20.99 63.79,17.34 61.57,24.01 60.14,24.8 61.57,25.75 67.6,23.69 67.6,26.23 63.79,20.99 74.9,6.39 70,18.13 50.93,21.47 25.37,46.39 25.37,41.31 7.91,20.5 39.74,19.17 59.66,31.79 50.14,17.02 74.92,29.25 27.57,1.25 8.3,29.43 73.79,49.57 72.2,49.57 47.59,48.77 49.66,48.77 45.69,46.71 23.27,43.56 70.93,41.47 73.79,40.04 70.93,39.96 70.93,45.44 70.93,43.53 63.79,15.43 56.48,28.29 68.07,22.42 26.48,13.37 26.48,15.12 34.9,11.47 40.61,43.85 39.34,46.87 34.9,10.2 37.44,40.2 30.45,46.55 41.72,43.85 65.53,36.39 42.52,20.99 31.72,7.81 34.9,4.64 42.52,4.48 56.8,14.64 68.07,8.45 71.57,8.45 42.52,16.55 56.48,26.07 63.47,26.55 63.47,23.37 65.69,26.07 65.69,23.85 74.9,18.29 61.88,30.36 48.23,6.39 67.3,18.13 32.36,1.31 51.88,11.94
  pour Bottom (rank 2): -0.03,0.04 76.1,0.04 76.1,52.04 -0.03,52.04
  pour Top (rank 2): -0.03,0.04 76.1,0.04 76.1,52.04 -0.03,52.04
GPIO
  Top 0.203: IC4.25 57.52,14.4 58.39,13.53 60.14,13.53 61.72,11.94 62.68,11.94 62.72,11.9 T8.6
HDMI_5V
  Top 0.254: 67.28,28.33 C23.2 | 65.27,28.33 HPWR.1 | 66.33,28.49 66.33,28.33
  Top 0.305: 66.33,28.49 66.33,34.01 66.96,34.64 68.23,34.64 68.71,35.12 68.71,35.6 68.27,36.04 HDMI.18 | 67.28,28.33 66.33,28.33 65.27,28.33
HDMI_DECT
  Top 0.203: HDMI.19 65.29,35.54 R2.1
HSYNC  (via drill 0.3)
  Top 0.152: 20.32,36.71 U1.27 29.76,36.76
  Top 0.203: IC1.48 54.66,28.06 v55.06,27.66
  Top 0.254: 29.76,36.76 v29.82,36.71
  Bottom 0.15: 41.56,29.88 45.05,26.39
  Bottom 0.203: v29.82,36.71 39.34,36.71 41.56,34.49 41.56,29.88 | 45.05,26.39 54.58,26.39 55.06,26.87 v55.06,27.66
HWB
  Top 0.203: IC4.33 61.52,15.48 62.2,14.8 64.88,14.8 R15.1
LED1  (via drill 0.3)
  Top 0.203: IC4.31 60.52,15.05 62.04,13.53 65.85,13.53 66.33,13.05 v67.28,13.05 | R18.1 v69.98,14.96
  Bottom 0.203: v67.28,13.05 69.19,14.96 v69.98,14.96
LED2  (via drill 0.3)
  Top 0.203: IC4.32 61.02,15.18 62.2,14.01 66.49,14.01 v66.65,13.85 | R19.1 v69.98,16.55
  Bottom 0.203: v66.65,13.85 69.34,16.55 v69.98,16.55
LED+
  Top 0.203: LED+.1
  Top 0.254: IC3.5 29.34,14.48 29.02,14.17 25.37,14.17 | C9.2
  Top 0.406: 29.16,7.5 D6.C
  Top 0.61: LED+.1 25.37,14.17 25.37,8.61 26.48,7.5 C9.2 | C9.2 29.16,7.5
LED-
  Top 0.406: 32.51,15.5 IC3.3 32.83,15.43 33.14,15.74 LED-.1 33.14,16.85 33.17,16.89 RS1.2 RS2.2 RS3.2 RS4.2 RS5.2
LEDC
  Top 0.406: 32.04,17.18 LED-.2
LIGHT  (via drill 0.3)
  Top 0.203: IC4.40 62.97,19.59 63.79,18.77 | 63.79,18.77 C16.2 R16.2 | v63.63,18.77 63.79,18.77
  Bottom 0.203: v63.63,18.77 62.2,17.34 62.2,15.75 59.82,13.37 58.87,13.37 58.23,12.74 58.23,8.93 55.02,5.72 55.02,5.56
  Bottom 0.406: 55.02,5.56 55.02,4.82 RPI.11
LV_GPIO  (via drill 0.3)
  Top 0.203: 59.5,5.43 58.71,6.23 52.67,6.23 50.77,8.13 44.58,8.13 43.31,9.4 TP_INT.2 | R24.1 62.2,9.86 | 62.2,9.86 62.64,9.86 T8.1 | v62.2,8.93 62.2,9.86
  Top 0.406: RPI.7 59.5,5.43
  Bottom 0.203: 60.14,5.59 62.2,7.66 v62.2,8.93
  Bottom 0.406: 60.14,5.59 60.14,4.82 RPI.7
LV_PWM2  (via drill 0.3)
  Top 0.203: R25.1 64.3,11.81 T8.4 64.22,12.15 63.79,12.58 61.72,12.58 60.3,14.01 58.87,14.01 58.39,14.48 v58.39,14.64
  Bottom 0.203: 34.9,13.05 50.61,13.05 54.1,16.55 56.8,16.55 58.39,14.96 v58.39,14.64
LV_RXD  (via drill 0.3)
  Top 0.203: R22.1 57.56,9.86 T7.1 57.64,9.52 58.39,8.77 60.93,8.77 v61.09,8.93
  Bottom 0.203: 59.5,2.89 58.87,3.53 58.87,5.75 61.09,7.97 v61.09,8.93
  Bottom 0.406: RPI.8 59.5,2.89
LV_SCL
  Top 0.203: 62.02,5.45 60.61,6.86 52.99,6.86 52.04,7.82 52.04,8.77 | 52.04,8.77 46.8,8.77 46.17,9.4 TP_SCL.2 | T6.1 52.96,9.86 R20.1 52.04,8.77
  Top 0.406: 62.02,5.45 62.02,5.44 RPI.5
LV_SDA  (via drill 0.3)
  Top 0.203: v53.31,7.66 53.47,7.5 62.52,7.5 64.56,5.45 | R21.1 54.74,11.81 | 54.74,11.81 54.61,11.81 | 54.61,11.81 T6.4 | TP_SDA.2 v44.74,8.93 | 54.61,11.81 54.6,11.81 54.58,11.78 | v54.74,12.58 54.74,11.81
  Top 0.406: 64.56,5.45 64.56,5.44 RPI.3
  Bottom 0.203: v54.74,12.58 54.74,9.09 v53.31,7.66 53.15,7.5 46.17,7.5 v44.74,8.93
LV_TXD  (via drill 0.3)
  Top 0.203: T7.4 59.22,11.81 R23.1 60.91,11.81 v60.93,11.78
  Bottom 0.203: v60.93,11.78 60.93,9.72 60.14,8.93 59.5,8.93 56.33,5.75 56.33,3.53 56.96,2.89
  Bottom 0.406: RPI.10 56.96,2.89
LX
  Top 0.203: 33.15,11.08 L1.2 | 33.94,7.84 D6.A
  Top 0.406: IC3.1 32.44,12.97 | 33.15,12.26 33.15,11.08
  Top 0.61: 32.44,12.97 33.15,12.26 | L1.2 33.24,9.63 33.94,8.93 33.94,7.84
MISO
  Top 0.152: IC4.11 56.1,22.49 54.58,24.01 50.93,24.01 50.29,23.37 50.29,18.61 49.02,17.34
  Top 0.406: 49.02,17.34 ISP.MISO
MOSI
  Top 0.152: 46.33,19.25 46.96,18.61 49.18,18.61 49.98,19.4 49.98,23.53 50.77,24.33 54.74,24.33 55.85,23.21 56.8,23.21 57.02,22.99 IC4.10
  Top 0.406: ISP.MOSI 46.33,19.25
N$1
  Top 0.406: RS3.1 36.64,15.44 36.01,14.8 J20_2.1
N$3
  Top 0.203: IC1.44 52.66,27.03 R10.1
N$4
  Top 0.406: RS4.1 37.75,15.28 37.44,14.96 J30_1.1
N$5
  Top 0.406: RS2.1 35.53,15.59 34.58,14.64 J20_1.1
N$6
  Top 0.203: R26.2 66.49,8.13 67.6,7.02 71.41,7.02 72.52,8.13 72.52,10.04 73,10.51 73.75,10.51
  Top 0.406: SW1.2 73.75,10.51 SW1.1
N$7
  Top 0.406: RS5.1 J30_2.1
N$8
  Top 0.61: IC6.3 17.61,4.64 17.1,4.14 17.1,3.43 RS7.2 17.27,3.34 RS9.2 RS10.2 RS11.2 RS12.2 RS13.2 RS8.1
N$11
  Top 0.254: U1.32 12.69,35.77 RS6.1
N$15
  Top 0.406: L5.2 17.6,7.62 IC6.1
  Top 0.61: L5.2 17.6,14.67 D2.A
N$17
  Top 0.203: R18.2 LED1.A
N$18
  Top 0.203: R19.2 LED2.A
OCKINV
  Top 0.203: IC1.100 43.66,45.95 44.42,46.71 44.42,47.98 44.12,48.28 OCK.1 R5.2
PDO
  Top 0.152: 32.67,36.71 32.67,36.7 32.65,36.7
  Top 0.203: 32.67,36.71 35.21,36.71 37.73,39.22 R9.1 39.84,39.22 40.04,39.03 IC1.9
PI+
  Top 0.254: SJ1.1 25,5 25,5.44
  Top 0.61: IC6.5 22.66,6.66 C27.2 23.2,6.68 SJ1.1 24.9,4.9 RS8.2 | D2.C 22.16,14.9 22.2,14.94 22.2,14.84 22.3,14.74 23.8,14.74 24.3,14.24 24.3,7.44 25,6.74 25,5.44
PIXS
  Top 0.203: IC1.4 40.4,41.53 39.18,42.74 39.18,45.6 40.61,47.03 40.61,47.98 40.91,48.28 PIXS.1 R6.2
PWM1  (via drill 0.3, 0.5 pad 0.25)
  Top 0.2: v22.59,4.55 v22.6,4.54 | v31.6,4.34 v33.2,5.94
  Top 0.203: IC3.4 29.5,15.43 | 29.5,15.43 29.18,15.12 RE1.2 | IC3.4 29.5,15.43 29.5,15.44 | RE2.1 29.05,16.05 29.5,15.59 29.5,15.44 | 29.5,15.44 29.5,15.43 | IC4.29 59.52,14.82 v59.34,14.64 | IC3.4 v31.08,15.43 v31.09,15.44
  Top 0.254: 31.3,4.04 v31.6,4.34
  Bottom 0.2: v22.6,4.54 28.1,4.54 28.5,4.14 31.4,4.14 v31.6,4.34 | v33.2,5.94 33.2,10.54 31.1,12.64 31.1,15.42 v31.09,15.44
  Bottom 0.203: v31.09,15.44 31.72,15.44 34.74,12.42 50.77,12.42 54.42,16.07 56.48,16.07 57.44,15.12 57.44,13.85 | 54.42,2.89 53.79,3.53 53.79,5.59 57.44,9.24 57.44,13.85 | v59.34,14.64 59.34,14.48 58.71,13.85 57.44,13.85
  Bottom 0.406: RPI.12 54.42,2.89
PWM2
  Top 0.203: IC4.30 60.02,14.91 61.88,13.05 65.38,13.05 66.17,12.26 66.17,10.36 65.53,9.72 64.43,9.72 T8.3
PWM3  (via drill 0.5 pad 0.25)
  Top 0.254: RE3.1 20.6,4.44 v21.3,4.44 | v29.9,3.14 29.91,3.15 RE4.2 32.1,3.14 32.6,2.64 v36.5,2.64 | IC4.28 59.02,16.36 59.2,16.54 61.6,16.54 v62.7,15.44 | v61,3.54 v48.3,3.54
  Top 0.305: IC6.4 20.49,5.23 RE3.1
  Bottom 0.254: v21.3,4.44 22.6,3.14 v29.9,3.14 | v62.7,15.44 62.7,9.54 62.8,9.44 62.8,6.84 61.4,5.44 61.4,3.94 v61,3.54 | v48.3,3.54 37.4,3.54 v36.5,2.64
R0
  Top 0.15: 15.88,26.76 19.4,23.24 36.5,23.24 40.2,26.94 44.1,26.94 44.9,27.74 45.2,27.74 45.6,28.14
  Top 0.2: U1.50 15.88,26.76 | 45.7,28.98 IC1.30 45.6,28.97 45.6,28.14
R1  (via drill 0.5 pad 0.25, 0.5 pad 0.61)
  Top 0.15: 46.16,28.1 44.2,26.14 v42.4,26.14 | 20.3,24.24 21.5,24.24 22,24.74 v32.7,24.74
  Top 0.2: IC1.31 46.16,28.1 | 20.3,24.24 U1.2
  Bottom 0.15: v42.4,26.14 37.7,26.14 arc90 37,25.44 arc-90 36.3,24.74 v32.7,24.74
R2
  Top 0.15: 15.8,26.24 19.4,22.64 37.4,22.64 40,25.24 43.9,25.24 46.6,27.94
  Top 0.152: U1.51 12.73,26.24
  Top 0.2: 12.73,26.24 15.8,26.24 | 46.6,27.94 46.6,28.97 IC1.32
R3
  Top 0.15: 15.57,25.77 19.4,21.94 37.3,21.94 40.2,24.84 44.1,24.84 47.2,27.94
  Top 0.2: U1.52 15.57,25.77 | 47.2,27.94 47.2,28.98 IC1.33
R4
  Top 0.15: 15.86,24.78 19.4,21.24 37.3,21.24 40.4,24.34 44.3,24.34 47.7,27.74
  Top 0.2: U1.54 15.86,24.78 | 47.7,27.74 47.7,28.98 IC1.34
R5
  Top 0.15: 15.67,24.27 19.4,20.54 37.3,20.54 40.6,23.84 44.4,23.84 48.2,27.64
  Top 0.152: IC1.35
  Top 0.2: U1.55 15.67,24.27 | 48.2,27.64 48.2,28.98 IC1.35
R6
  Top 0.15: 48.66,27.4 44.6,23.34 40.7,23.34 37.3,19.94 19.2,19.94 15.4,23.74
  Top 0.2: IC1.36 48.66,27.4 | 15.4,23.74 13.4,23.74 13.3,23.84
  Top 0.254: 13.3,23.84 13.22,23.76 U1.56
R7  (via drill 0.5 pad 0.61)
  Top 0.15: IC1.37 49.16,26 47,23.84 47,21.54 46.6,21.14 44.1,21.14 42.4,22.84 40.9,22.84 37.4,19.34 18.3,19.34 v16.9,20.74
  Top 0.2: v18.4,25.24 18.86,24.78 U1.3
  Bottom 0.15: v16.9,20.74 16.9,23.74 v18.4,25.24
RST  (via drill 0.3)
  Top 0.203: IC4.13 55.12,21.09 54.1,22.1 v54.1,22.58 53.79,22.9 R12.1
  Bottom 0.203: v54.1,22.58 53.95,22.42 49.02,22.42
  Bottom 0.406: ISP.RST 49.02,22.42
RX0+
  Top 0.2: U1.47 10.42,28.26 7.1,24.94 7.1,23.44 6.5,22.84 4.34,22.84 SV1.8
RX0-
  Top 0.2: U1.48 10.74,27.77 7.7,24.74 7.7,22.34 7,21.64 5.68,21.64 SV1.7
RX1+
  Top 0.2: SV1.10 4.4,25.44 6.2,25.44 10,29.24 12.66,29.24 U1.45
RX1-
  Top 0.2: SV1.9 5.65,24.19 10.2,28.74 12.67,28.74 U1.46
RX2+
  Top 0.15: U1.41 7.34,31.28
  Top 0.2: 7.34,31.28 6.6,30.54 2.3,30.54 1.7,29.94 1.7,28.1 SV1.12
RX2-
  Top 0.15: 12.66,30.74 7.9,30.74
  Top 0.2: 12.66,30.74 U1.42 | 7.9,30.74 7.1,29.94 7.1,28.13 SV1.11
RX3_N  (3 unrouted)
  Top 0.2: SV1.19 5.69,36.85
RX3_P  (1 unrouted)
RXD
  Top 0.203: IC4.20 54.98,17.59 54.26,16.86 54.26,14.17 55.69,12.74 56.8,12.74 57.64,11.9 T7.6
SCDT
  Top 0.203: IC1.8 40.49,39.53 39.79,40.22 R9.2
SCK
  Top 0.152: 49.02,19.88 49.66,20.52 49.66,23.69 50.61,24.64 54.9,24.64 55.85,23.69 56.96,23.69 57.52,23.13 IC4.9
  Top 0.406: ISP.SCK 49.02,19.88
SCL  (via drill 0.3)
  Top 0.203: v58.07,20.99 58.07,19.72 56.94,18.59 IC4.18 54.72,18.59 53.31,17.18 53.31,13.85 53.04,13.57 T6.6 | SCL.2 60.45,27.98 60.3,27.82 59.18,27.82 v58.71,27.34
  Bottom 0.203: v58.07,20.99 58.07,26.71 v58.71,27.34
SDA  (via drill 0.3)
  Top 0.203: v53.79,13.21 53.79,17.02 54.85,18.09 IC4.19 57.23,18.09 59.18,20.04 v59.18,20.99 | SDA.2 62.84,27.82 61.88,26.87 v60.61,26.87 | T6.3 54.54,9.52 53.95,8.93 v53.31,8.93
  Bottom 0.203: v59.18,20.99 59.18,25.44 v60.61,26.87 | v53.31,8.93 53.79,9.4 v53.79,13.21
SENSE  (1 unrouted)
  Top 0.254: IC4.26 58,15.71 58,16.44
SHLD1
  Top 0.203: USB.SHLD2 73.32,24 73.31,24.01 | USB.SHLD1 73.34,22.07 73.31,22.1
  Top 0.406: 73.31,26.23 73.31,24.01 73.31,22.1 73.31,19.09 72.36,18.13 R17.2
SHLD3
  Top 0.406: R1.2 71.69,31.94 HDMI.SHLD2
  Bottom 0.406: 71.88,32.58 68.1,32.58 HDMI.SHLD1 | 71.88,32.58 73,32.58 HDMI.SHLD2 | 71.88,32.58 71.88,47.03 | 71.88,47.03 73,47.03 HDMI.SHLD3 | 71.88,47.03 HDMI.SHLD4
ST
  Top 0.203: IC1.3 40.69,42.03 39.82,42.9 39.82,45.44 40.29,45.92 41.56,45.92 41.88,46.23 41.88,47.98 42.18,48.28 ST.1 R7.2
STAG
  Top 0.203: IC1.7 40.78,40.03 38.39,42.42 38.39,47.03 39.64,48.28 STAG.2 R8.1
SW1  (via drill 0.3)
  Top 0.203: IC4.22 55.41,16.59 55.37,16.55 55.37,15.12 v55.85,14.64 | R26.1 56.48,8.13 v55.69,8.93
  Bottom 0.203: v55.85,14.64 55.85,9.09 v55.69,8.93 55.69,8.77 52.52,5.59 | 52.52,4.82 RPI.13
  Bottom 0.406: 52.52,5.59 52.52,4.82
TXD  (via drill 0.3)
  Top 0.203: IC4.21 55.12,17.09 54.74,16.71 54.74,14.48 55.85,13.37 57.76,13.37 58.39,12.74 v59.34,12.74 | T7.3 59.34,9.72 v59.98,9.72
  Bottom 0.203: v59.34,12.74 59.34,10.36 v59.98,9.72
UCAP
  Top 0.203: IC4.6 C10.2
USBD_N
  Top 0.152: R14.1 64.9,24.33 65.38,24.81 66.17,24.81 66.17,24.8 D1.2 | D1.2 66.64,24.33 68.23,24.33 arc-90 68.55,24.01 68.55,23.21 arc90 69.38,22.39 USB.D- | D1.2
USBD_P
  Top 0.152: R13.1 64.9,25.6 65.38,25.11 66.17,25.11 D1.1 | D1.1 66.65,25.59 68.07,25.59 arc-90 69.02,24.64 69.02,23.85 arc90 69.83,23.04 USB.D+ | D1.1
VBUS
  Top 0.406: L3.2 | USB.VBUS 69.3,21.74 69.19,21.63
  Top 0.61: 69.19,21.63 68.55,20.99
  Top 0.813: L3.2 68.55,14.48 68.55,20.99
VCCIO  (via drill 0.3)
  Top 0.203: T6.2 53.79,10.83 T6.5 | T7.2 58.39,10.83 T7.5 | 65.19,10.83 R25.2 | R24.2 61.72,10.83 | R23.2 60.14,10.83 | T8.5 63.47,10.83 T8.2 v63.47,8.93 | R21.2 55.53,10.83 | R22.2 56.64,10.83 | R20.2 52.04,10.83
  Top 0.254: 65.19,10.83 63.47,10.83 61.72,10.83 60.14,10.83 58.39,10.83 56.64,10.83 55.53,10.83 53.79,10.83 52.04,10.83 51.56,10.83 51.09,10.36 51.09,9.88 50.61,9.4 49.5,9.4 49.02,9.88 VCCIO.2
  Bottom 0.203: 67.12,5.43 63.63,8.93 v63.47,8.93
  Bottom 0.406: RPI.1 67.12,5.43
VSYNC  (via drill 0.3)
  Top 0.152: U1.28 20.33,37.34 v32.99,37.34
  Top 0.203: 32.89,37.24 v32.99,37.34 | IC1.47 54.16,27.29 v54.26,27.18
  Bottom 0.203: v32.99,37.34 39.5,37.34 42.04,34.8 42.04,30.2 45.21,27.02 54.1,27.02 v54.26,27.18
X+  (via drill 0.3)
  Top 0.203: IC4.39 61.72,19.09 61.25,19.56 v61.09,19.56 | 32.67,38.93 v32.99,38.93 | v43.94,15.59 43.78,15.44 43.78,14.32 44.74,13.37 TP_SDA.1 | TP_BOT.4 37.03,48.84 v37.59,49.41
  Bottom 0.203: v61.09,19.56 60.61,19.56 59.66,18.61 52.99,18.61 49.98,15.59 v43.94,15.59 35.53,15.59 28.23,22.9 28.23,37.98 29.18,38.93 v32.99,38.93 34.1,38.93 37.59,42.42 v37.59,49.41
X-  (via drill 0.3)
  Top 0.203: 32.95,40.24 v32.99,40.2 35.85,40.2 37.75,42.11 37.75,46.87 | IC4.37 61.2,18.09 v61.09,17.98 | R11.1 38.7,48.3 37.75,47.34 37.75,46.87 | TP_BOT.2 37.73,46.84 37.75,46.87
  Bottom 0.203: v32.99,40.2 32.51,40.68 29.02,40.68 26.96,38.61 26.96,22.58 35.21,14.32 50.29,14.32 53.63,17.66 60.3,17.66 60.61,17.98 v61.09,17.98
XTAL1
  Top 0.203: IC4.17 54.26,19.09 52.9,17.73 Q1.2
XTAL2
  Top 0.203: IC4.16 53.76,19.59 53.22,20.13 Q1.1
Y+  (via drill 0.3)  (1 unrouted)
  Top 0.203: 28.14,40.74 v27.59,40.2 | IC4.36 61.65,17.59 61.25,17.18 v60.77,17.18 | 32.42,40.74 32.51,40.84 35.69,40.84 36.96,42.11 36.96,45.76 36.87,45.84 TP_BOT.1 | TP_INT.1 v43.31,13.69
  Bottom 0.203: v27.59,40.2 26.32,38.93 26.32,22.42 35.05,13.69 v43.31,13.69 50.45,13.69 53.95,17.18 v60.77,17.18
Y-  (via drill 0.3)
  Top 0.203: IC4.38 61.27,18.59 61.09,18.77 v60.77,18.77 | 29.96,39.74 v29.82,39.88 | v44.58,14.96 44.58,14.32 46.17,12.74 TP_SCL.1 | TP_BOT.3 34.6,47.84 v34.58,47.82
  Bottom 0.203: v60.77,18.77 60.61,18.77 59.98,18.13 53.31,18.13 50.14,14.96 v44.58,14.96 35.37,14.96 27.59,22.74 27.59,38.3 29.18,39.88 v29.82,39.88 30.13,39.57 33.62,39.57 34.58,40.52 v34.58,47.82
(copper drawn outside any net)
  shapes: Top area x2

## Text on the board
Top: TOP
Bottom: watterott.com | BOT
tPlace: HDMI-Display Rev 1.1 | github.com/watterott/HDMI-Display | o | 40 | 40 | watterott.com | EDID | (LED) | (LED) | GND | RST | o | 1 | 1 | 2 | 5V | 5V | 5V | 1 | 20 20 30 30 | LED Boost Converter | 3V3 | 5V | 1 | 16
Reference: Silkscreen: 21 tPlace